# Altium schematic sheet Battery Charger 2.SchDoc
size 209 x 297 mm; Author: Мурашкин Д.В.; Address1: Address1; Address2: Address2; Address3: Address3; Address4: Address4; DocumentNumber: SS19946-01; Scale: 1:1; Letter1Column: Э; PartName: Блок питания
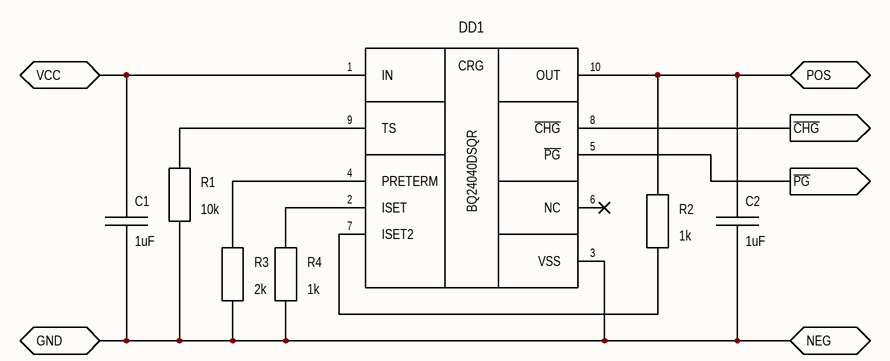
[diagram p0: Battery Charger 2.SchDoc]

## Parts
C1  1uF  [CAPC1608L]
C2  1uF  [CAPC1608L]
DD1  BQ24040DSQR  [WFDFN-10]
R1  10k  [RESC1608L]
R2  1k  [RESC1608L]
R3  2k  [RESC1608L]
R4  1k  [RESC1608L]

## Ports
GND, NEG, POS, VCC, ~{CHG} (out), ~{PG} (out)

## Nets
~{CHG}: DD1.8(~{CHG}) ; port ~{CHG}
GND: C1.2 C2.2 DD1.3(VSS) R1.2 R3.2 R4.2 ; port GND, port NEG
~{PG}: DD1.5(~{PG}) ; port ~{PG}
POS: C2.1 DD1.10(OUT) R2.1 ; port POS
VCC: C1.1 DD1.1(IN) ; port VCC
NetDD1_2: DD1.2(ISET) R4.1
NetDD1_4: DD1.4(PRETERM) R3.1
NetDD1_7: DD1.7(ISET2) R2.2
NetDD1_9: DD1.9(TS) R1.1

Not connected (* = marked no-connect by the designer): DD1 6(NC)*

## Notes on the sheet
- Перв. примен.
- Справ. №
- Подп. и дата
- Инв. № дубл.
- Взам. инв. №
- Разраб.
- Изм.
- Лист
- № докум.
- Подп.
- Дата
- Лит.
- Масса
- Масштаб
- Пров.
- Т.контр.
- Листов
- Инв. № подл.
- Утв.
- Н.контр.
- 2.106-A4
- Копировал
- Формат А4
- (in symbol BQ24040DSQR) CRG

## Library data of the parts
C1 C2 = CC0603KRX5R8BB105: Capacitor Ceramic 1uF 25V 0603(1608); Manufacturer: Yageo; Group: Ceramic Capacitors; Temperature Coefficient: X5R; Tolerance: ±10%; Voltage: 25; Short description: CAP CER 1UF 25V X5R 0603; Type: Ceramic; Part name: CC0603KRX5R8BB105; Package: 0603 (1608); Value: 1uF
DD1 = BQ24040DSQR: Battery Charger Li-ion/Li Polymer; Manufacturer: Texas Instruments; Group: PMIC - Battery Chargers; Package: WFDFN-10; Part name: BQ24040DSQR
R1 = RC0603JR-0710KL: Resistor Ceramic 10k 0.1W 0603(1608); Manufacturer: Yageo; Group: Resistors; Temperature Coefficient: ±100ppm/°C; Tolerance: ±5%; Voltage: 75 V; Part name: RC0603JR-0710KL; Type: Thin Film; Power: 0.1W; Package: 0603 (1608); Value: 10k
R2 R4 = RC0603JR-071KL: Resistor Ceramic 1k 0.1W 0603(1608); Manufacturer: Yageo; Group: Resistors; Temperature Coefficient: ±100ppm/°C; Tolerance: ±5%; Part name: RC0603JR-071KL; Type: Thin Film; Power: 0.1W; Package: 0603 (1608); Value: 1k
R3 = RC0603JR-072KL: Resistor Ceramic 2k 0.1W 0603(1608); Manufacturer: Yageo; Group: Resistors; Temperature Coefficient: ±100ppm/°C; Tolerance: ±5%; Part name: RC0603JR-072KL; Type: Thin Film; Power: 0.1W; Package: 0603 (1608); Value: 2k